# EAGLE design RGBW Controller31 (EAGLE 6.5.0)
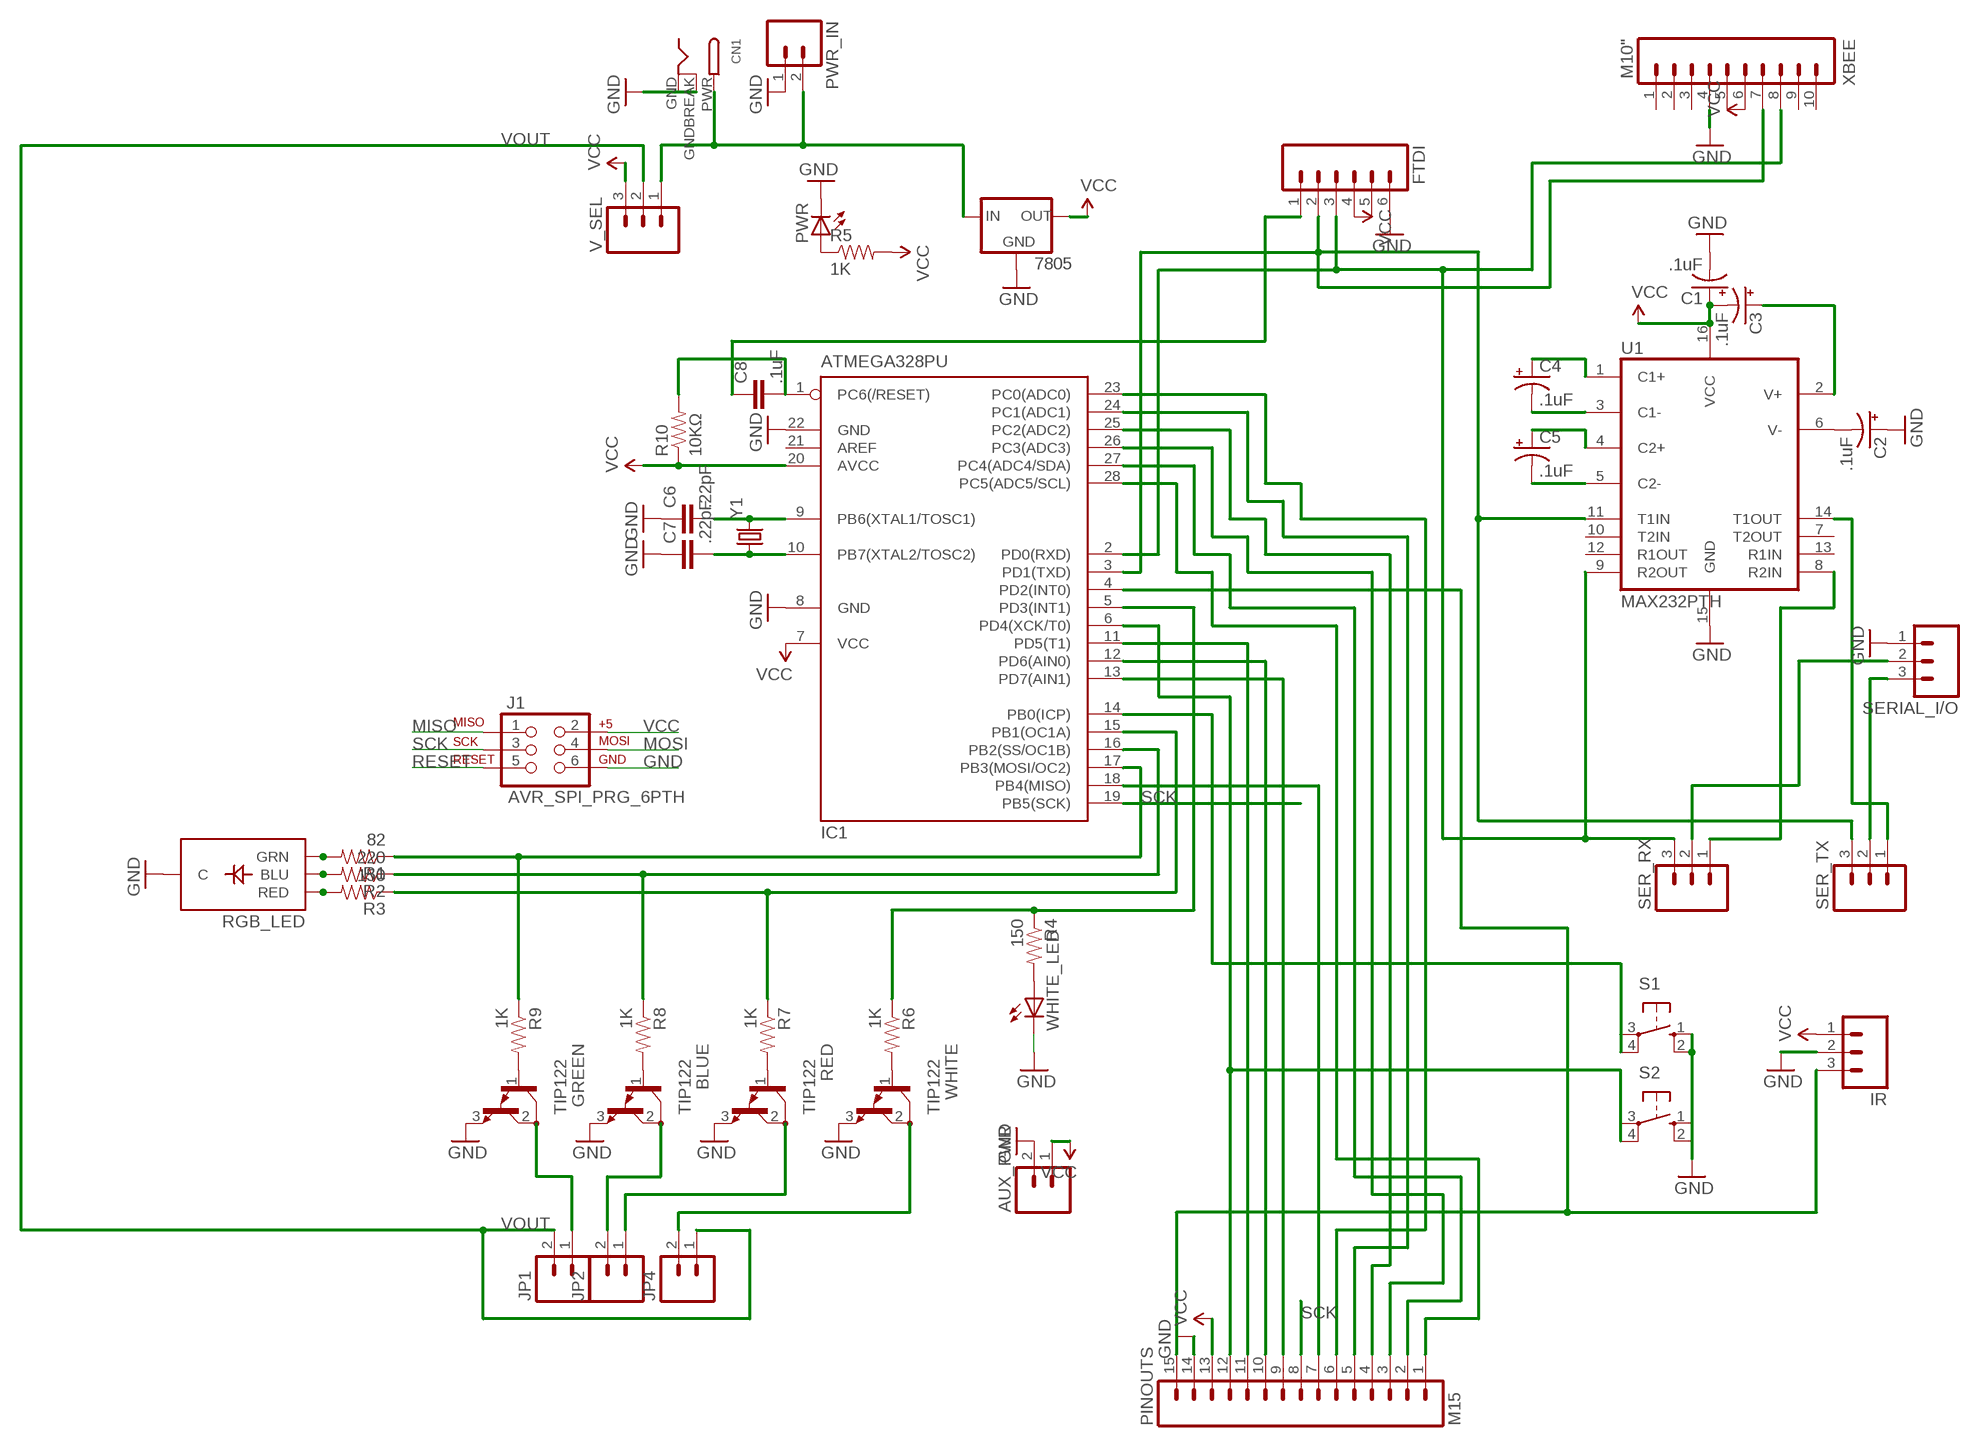
[diagram p0: schematic, sheet 1]

## Parts
7805  V_REG_78XXSIDE  [78XXL]
AUX_PWR  M02PTH  [1X02]
BLUE  TIP122  [TO220]
C1  .1uF  CAP_POLPTH1  [CPOL-RADIAL-100UF-25V]
C2  .1uF  CAP_POLPTH1  [CPOL-RADIAL-100UF-25V]
C3  .1uF  CAP_POLPTH1  [CPOL-RADIAL-100UF-25V]
C4  .1uF  CAP_POLPTH1  [CPOL-RADIAL-100UF-25V]
C5  .1uF  CAP_POLPTH1  [CPOL-RADIAL-100UF-25V]
C6  .22pF  CAPPTH  [CAP-PTH-SMALL]
C7  .22pF  CAPPTH  [CAP-PTH-SMALL]
C8  .1uF  CAPKIT  [CAP-PTH-SMALL-KIT]
CN1  DCBARRELPTH  [DCJACK_2MM_PTH]
FTDI  M06SIP  [1X06]
GREEN  TIP122  [TO220]
IC1  ATMEGA328PU  MEGA8-P  [DIL28-3]
IR  M03PTH  [1X03]
J1  AVR_SPI_PRG_6PTH  [2X3]
JP1  M025MM  [SCREWTERMINAL-5MM-2]
JP2  M025MM  [SCREWTERMINAL-5MM-2]
JP4  M025MM  [SCREWTERMINAL-5MM-2]
PINOUTS  M15  [1X15]
PWR  LED5MM  [LED5MM]
PWR_IN  M025MM  [SCREWTERMINAL-5MM-2]
R1  82  RESISTORPTH-1/4W  [AXIAL-0.4]
R2  220  RESISTORPTH-1/4W  [AXIAL-0.4]
R3  150  RESISTORPTH-1/4W  [AXIAL-0.4]
R4  150  RESISTORPTH-1/4W  [AXIAL-0.4]
R5  1K  RESISTORPTH-1/4W  [AXIAL-0.4]
R6  1K  RESISTORPTH-1/4W  [AXIAL-0.4]
R7  1K  RESISTORPTH-1/4W  [AXIAL-0.4]
R8  1K  RESISTORPTH-1/4W  [AXIAL-0.4]
R9  1K  RESISTORPTH-1/4W  [AXIAL-0.4]
R10  10KΩ  RESISTORPTH-1/4W  [AXIAL-0.4]
RED  TIP122  [TO220]
RGB_LED  LED-TRICOLOR-THROUGHHOLE  [LED-TRICOLOR-THROUGHHOLE]
S1  10-XX  [B3F-10XX]
S2  10-XX  [B3F-10XX]
SER_RX  M03PTH  [1X03]
SER_TX  M03PTH  [1X03]
SERIAL_I/O  M03SCREW  [SCREWTERMINAL-3.5MM-3]
U1  MAX232PTH  [DIL16]
V_SEL  M03PTH  [1X03]
WHITE  TIP122  [TO220]
WHITE_LED  LED5MM  [LED5MM]
XBEE  M10"  [1X10]
Y1  CRYSTALHC49US  [HC49US]

## Nets
GND: 7805.GND AUX_PWR.2 BLUE.3(E) C1.2(-) C2.1(+) C6.1 C7.1 CN1.GND CN1.GNDBREAK FTDI.6 GREEN.3(E) IC1.8(GND) IC1.22(GND) IR.2 J1.6 PINOUTS.14 PWR.K(C) PWR_IN.1 RED.3(E) RGB_LED.GND(C) S1.1(S) S1.2(S1) S2.1(S) S2.2(S1) SERIAL_I/O.1 U1.15(GND) WHITE.3(E) WHITE_LED.K(C) XBEE.4
MISO: IC1.18(PB4(MISO)) J1.1 PINOUTS.7
MOSI: IC1.17(PB3(MOSI/OC2)) J1.4 R1.P$1 R9.P$1
N$1: R1.P$2 RGB_LED.GRN
N$2: R2.P$2 RGB_LED.BLU
N$3: R3.P$2 RGB_LED.RED
N$4: R4.P$2 WHITE_LED.A
N$5: PWR.A R5.P$1
N$6: C5.1(+) U1.4(C2+)
N$7: C4.2(-) U1.3(C1-)
N$8: C4.1(+) U1.1(C1+)
N$9: C5.2(-) U1.5(C2-)
N$11: C3.1(+) U1.2(V+)
N$12: C2.2(-) U1.6(V-)
N$13: IC1.5(PD3(INT1)) R4.P$1 R6.P$1
N$14: IC1.15(PB1(OC1A)) R3.P$1 R7.P$1
N$15: IC1.16(PB2(SS/OC1B)) R2.P$1 R8.P$1
N$17: C6.2 IC1.9(PB6(XTAL1/TOSC1)) Y1.2
N$18: C7.2 IC1.10(PB7(XTAL2/TOSC2)) Y1.1
N$19: IC1.4(PD2(INT0)) IR.3 PINOUTS.15
N$20: 7805.IN CN1.PWR PWR_IN.2 V_SEL.1
N$21: GREEN.2(C) JP1.1
N$23: BLUE.2(C) JP2.2
N$24: JP2.1 RED.2(C)
N$25: JP4.2 WHITE.2(C)
N$26: IC1.14(PB0(ICP)) S1.3(P) S1.4(P1)
N$28: C8.1 FTDI.1
N$29: FTDI.2 IC1.3(PD1(TXD)) SER_TX.3 U1.11(T1IN) XBEE.7
N$30: FTDI.3 IC1.2(PD0(RXD)) SER_RX.3 U1.9(R2OUT) XBEE.8
N$32: IC1.13(PD7(AIN1)) PINOUTS.9
N$33: IC1.12(PD6(AIN0)) PINOUTS.10
N$34: IC1.11(PD5(T1)) PINOUTS.11
N$35: IC1.26(PC3(ADC3)) PINOUTS.3
N$36: IC1.27(PC4(ADC4/SDA)) PINOUTS.2
N$37: IC1.28(PC5(ADC5/SCL)) PINOUTS.1
N$38: IC1.6(PD4(XCK/T0)) PINOUTS.12 S2.3(P) S2.4(P1)
N$39: IC1.25(PC2(ADC2)) PINOUTS.4
N$40: IC1.24(PC1(ADC1)) PINOUTS.5
N$41: IC1.23(PC0(ADC0)) PINOUTS.6
N$42: SER_TX.2 SERIAL_I/O.3
N$43: SER_RX.2 SERIAL_I/O.2
N$44: SER_TX.1 U1.14(T1OUT)
N$45: SER_RX.1 U1.8(R2IN)
N$46: R7.P$2 RED.1(B)
N$47: BLUE.1(B) R8.P$2
N$48: GREEN.1(B) R9.P$2
N$49: R6.P$2 WHITE.1(B)
RESET: C8.2 IC1.1(PC6(/RESET)) J1.5 R10.P$2
SCK: IC1.19(PB5(SCK)) J1.3 PINOUTS.8
VCC: 7805.OUT AUX_PWR.1 C1.1(+) C3.2(-) FTDI.4 IC1.7(VCC) IC1.20(AVCC) IR.1 J1.2 PINOUTS.13 R5.P$2 R10.P$1 U1.16(VCC) V_SEL.3 XBEE.6
VOUT: JP1.2 JP4.1 V_SEL.2
Unconnected: FTDI.5 IC1.21(AREF) U1.7(T2OUT) U1.10(T2IN) U1.12(R1OUT) U1.13(R1IN) XBEE.1 XBEE.2 XBEE.3 XBEE.5 XBEE.9 XBEE.10

## Library data of the parts
7805 = SparkFun:V_REG_78XX: Voltage Regulator Standard 7805 5V regulator. IGO (Input Ground Output). Spark Fun Electronics SKU : COM-00107
AUX_PWR JP1 JP2 JP4 PWR_IN = SparkFun:M02: Header 2 Standard 2-pin 0.1" header. Use with straight break away headers (SKU : PRT-00116), right angle break away headers (PRT-00553), swiss pins (PRT-00743), machine pins (PRT-00117), and female headers (PRT-00115). Molex polarized connector foot print use with SKU : PRT-08233 with associated crimp pins and housings.
BLUE GREEN RED WHITE = transistor:TIP122: NPN BIPOLAR DARLINGTON TRANSISTOR
C1-C5 = SparkFun:CAP_POL: Capacitor Polarized These are standard SMD and PTH capacitors. Normally 10uF, 47uF, and 100uF in electrolytic and tantalum varieties. Always verify the external diameter of the through hole cap, it varies with capacity, voltage, and manufacturer. The EIA devices should be standard.
C6-C8 = SparkFun:CAP: Capacitor Standard 0603 ceramic capacitor, and 0.1" leaded capacitor.
CN1 = adafruit:DCBARREL: 2.0mm DC Barrel Jack DCJACK_2MM_PTH - Through Hole Jack (4UConnector: 05537)
FTDI = SparkFun:M06: Header 6 Standard 6-pin 0.1" header. Use with straight break away headers (SKU : PRT-00116), right angle break away headers (PRT-00553), swiss pins (PRT-00743), machine pins (PRT-00117), and female headers (PRT-00115). Molex polarized connector foot print use with SKU : PRT-08094 with associated crimp pins and housings. NOTES ON THE VARIANTS LOCK and LOCK_LONGPADS... This footprint was designed to help hold the alignment of a through-hole component (i.e. 6-pin header) while soldering it into place. You may notice that each hole has been shifted either up or down by 0.005 of an inch from it's more standard position (which is a perfectly straight line). This slight alteration caused the pins (the squares in the middle) to touch the edges of the holes. Because they are alternating, it causes a "brace" to hold the component in place. 0.005 has proven to be the perfect amount of "off-center" position when using our standard breakaway headers. Although looks a little odd when you look at the bare footprint, once you have a header in there, the alteration is very hard to notice. Also, if you push a header all the way into place, it is covered up entirely on the bottom side. This idea of altering the position of holes to aid alignment will be further integrated into the Sparkfun Library for other footprints. It can help hold any component with 3 or more connection pins.
IC1 = atmel:MEGA8-P: MICROCONTROLLER 8 Kbytes FLASH, 1 kbytes SRAM, 512 bytes EEPROM, USART, 4-channel 10 bit ADC, 2-channel 8 bit ADC Pin compatible with Atmega48, ATMega88, ATMega168 Source: avr.lbr
IR SER_RX SER_TX SERIAL_I/O V_SEL = SparkFun:M03: Header 3 Standard 3-pin 0.1" header. Use with straight break away headers (SKU : PRT-00116), right angle break away headers (PRT-00553), swiss pins (PRT-00743), machine pins (PRT-00117), and female headers (PRT-00115). Molex polarized connector foot print use with SKU : PRT-08232 with associated crimp pins and housings.
J1 = SparkFun:AVR_SPI_PRG_6: AVR ISP 6 Pin This is the reduced ISP connector for AVR programming. Common on Arduino. This footprint will take up less PCB space and can be used with a 10-pin to 6-pin adapter such as SKU: BOB-08508
PINOUTS = SparkFun:M15: Header 15 Standard 15-pin 0.1" header. Use with straight break away headers (SKU : PRT-00116), right angle break away headers (PRT-00553), swiss pins (PRT-00743), machine pins (PRT-00117), and female headers (PRT-00115).
PWR WHITE_LED = led:LED: LED OSRAM: - CHIPLED LG R971, LG N971, LY N971, LG Q971, LY Q971, LO R971, LY R971 LH N974, LH R974 LS Q976, LO Q976, LY Q976 LO Q996 - Hyper CHIPLED LW Q18S LB Q993, LB Q99A, LB R99A - SideLED LS A670, LO A670, LY A670, LG A670, LP A670 LB A673, LV A673, LT A673, LW A673 LH A674 LY A675 LS A676, LA A676, LO A676, LY A676, LW A676 LS A679, LY A679, LG A679 - Hyper Micro SIDELED® LS Y876, LA Y876, LO Y876, LY Y876 LT Y87S - SmartLED LW L88C, LW L88S LB L89C, LB L89S, LG L890 LS L89K, LO L89K, LY L89K LS L896, LA L896, LO L896, LY L896 - TOPLED LS T670, LO T670, LY T670, LG T670, LP T670 LSG T670, LSP T670, LSY T670, LOP T670, LYG T670 LG T671, LOG T671, LSG T671 LB T673, LV T673, LT T673, LW T673 LH T674 LS T676, LA T676, LO T676, LY T676, LB T676, LH T676, LSB T676, LW T676 LB T67C, LV T67C, LT T67C, LS T67K, LO T67K, LY T67K, LW E67C LS E67B, LA E67B, LO E67B, LY E67B, LB E67C, LV E67C, LT E67C LW T67C LS T679, LY T679, LG T679 LS T770, LO T770, LY T770, LG T770, LP T770 LB T773, LV T773, LT T773, LW T773 LH T774 LS E675, LA E675, LY E675, LS T675 LS T776, LA T776, LO T776, LY T776, LB T776 LHGB T686 LT T68C, LB T68C - Hyper Mini TOPLED® LB M676 - Mini TOPLED Santana® LG M470 LS M47K, LO M47K, LY M47K Source: http://www.osram.convergy.de LUXEON: - LUMILED® LXK2-PW12-R00, LXK2-PW12-S00, LXK2-PW14-U00, LXK2-PW14-V00 LXK2-PM12-R00, LXK2-PM12-S00, LXK2-PM14-U00 LXK2-PE12-Q00, LXK2-PE12-R00, LXK2-PE12-S00, LXK2-PE14-T00, LXK2-PE14-U00 LXK2-PB12-K00, LXK2-PB12-L00, LXK2-PB12-M00, LXK2-PB14-N00, LXK2-PB14-P00, LXK2-PB14-Q00 LXK2-PR12-L00, LXK2-PR12-M00, LXK2-PR14-Q00, LXK2-PR14-R00 LXK2-PD12-Q00, LXK2-PD12-R00, LXK2-PD12-S00 LXK2-PH12-R00, LXK2-PH12-S00 LXK2-PL12-P00, LXK2-PL12-Q00, LXK2-PL12-R00 Source: www.luxeon.com KINGBRIGHT: KA-3528ASYC Source: www.kingbright.com
R1-R10 = SparkFun:RESISTOR: Resistor Basic schematic elements and footprints for 0603, 1206, and PTH resistors.
RGB_LED = SparkFun:LED-TRICOLOR-THROUGHHOLE
S1 S2 = switch-omron:10-XX: OMRON SWITCH; MPN: B3F-1000; OC_FARNELL: 176432; OC_NEWARK: 36M3542
U1 = SparkFun:MAX232: RS232 Transceiver Very common IC. This is generically called 'MAX232', but works with the 3V equivalent MAX3232 generic ICs. Field tested and mother approved. Spark Fun Electronics SKU : COM-00316 (DIP) and COM-00589 (SMD)
XBEE = SparkFun:M10: Header 10 Standard 10-pin 0.1" header. Use with straight break away headers (SKU : PRT-00116), right angle break away headers (PRT-00553), swiss pins (PRT-00743), machine pins (PRT-00117), and female headers (PRT-00115).
Y1 = SparkFun:CRYSTAL: Crystals Various standard crystals. Proven footprints. Spark Fun Electronics SKU : COM-00534

## Board
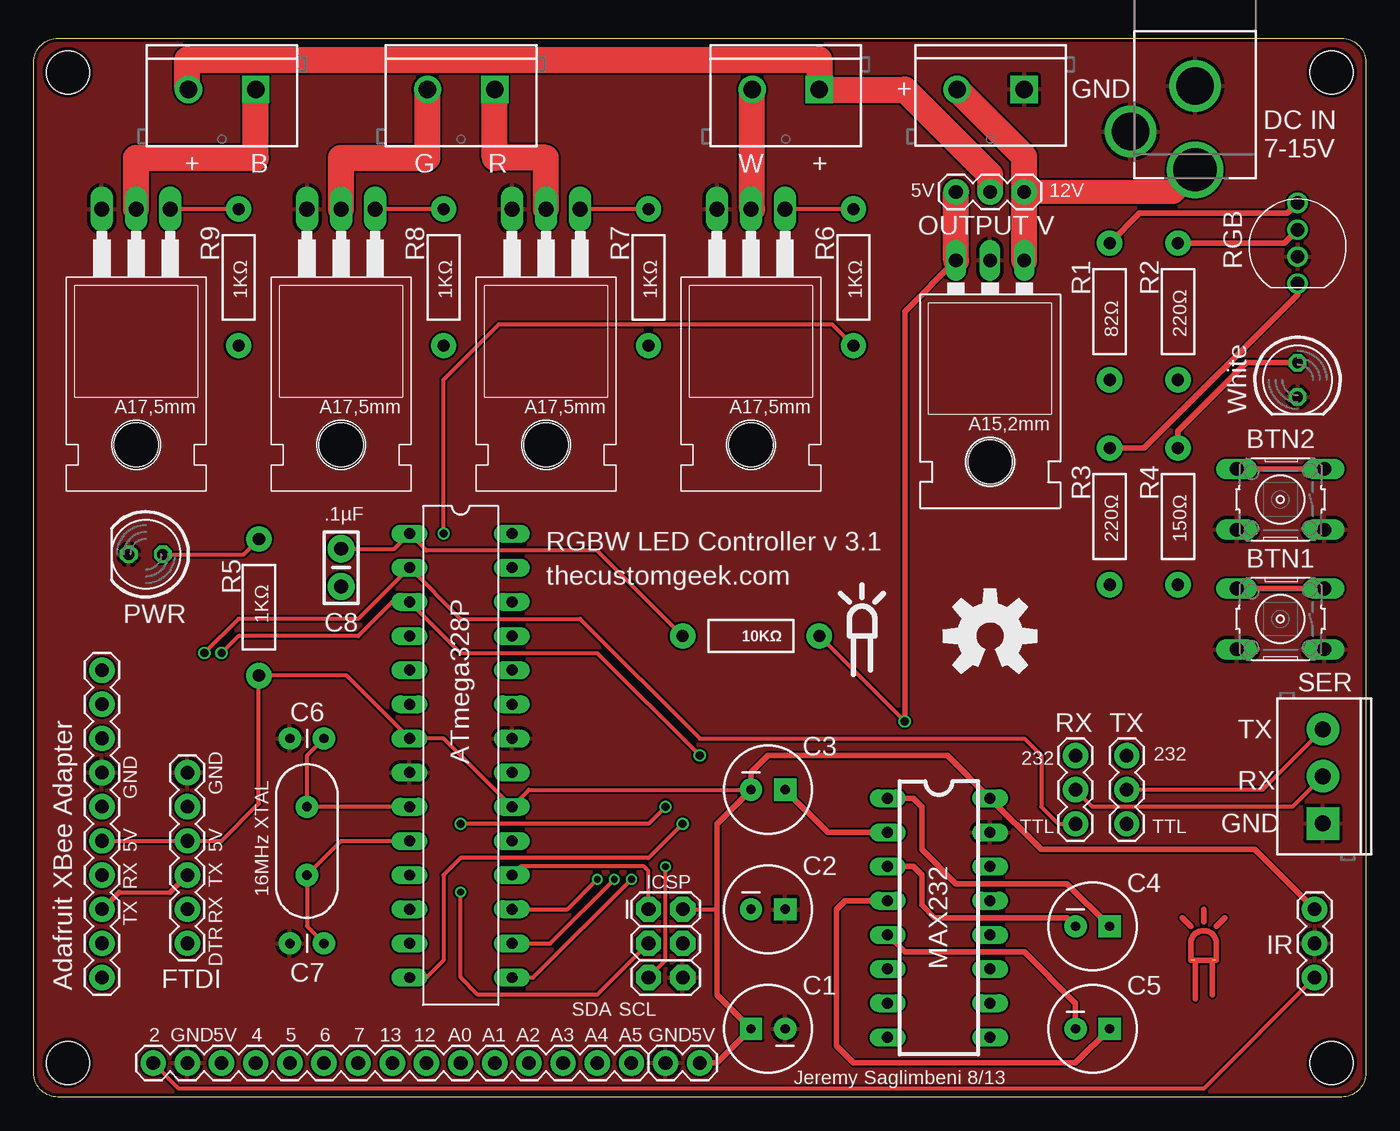
[diagram p1: board, top side]
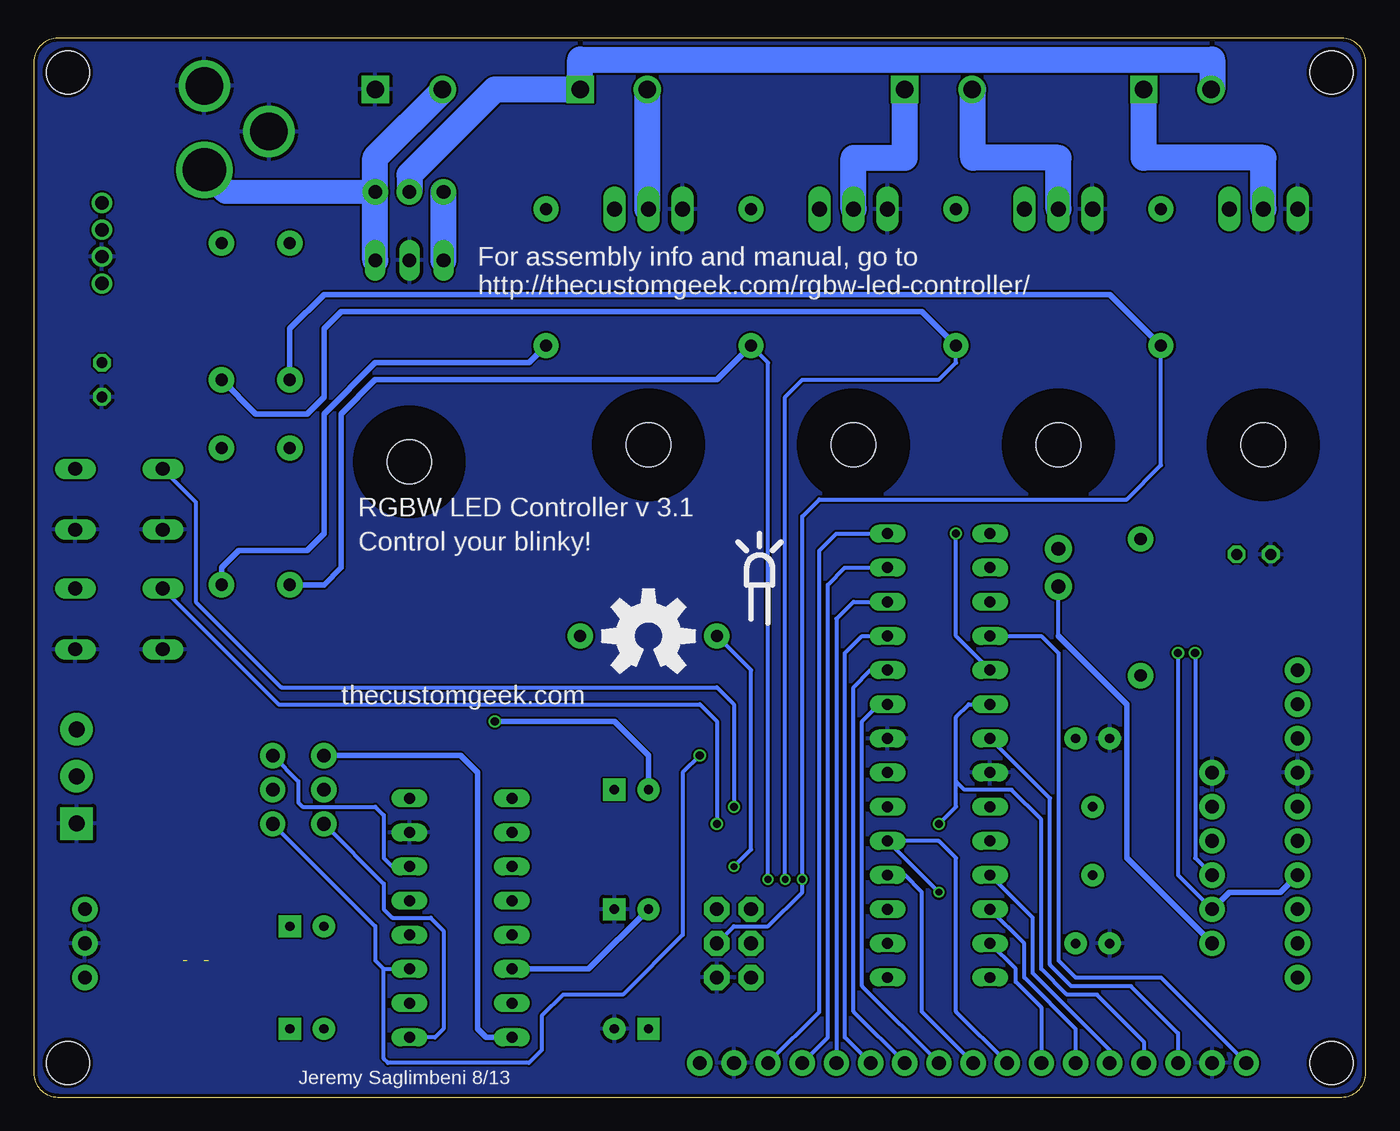
[diagram p2: board, bottom side, seen from below]

Size 99.06 x 78.74 mm. Coordinates in mm from the lower left corner, seen from the top.
Outline: 99.06,76.94 99.06,1.8 arc-90 97.26,0 1.8,0 arc-90 0,1.8 0,76.94 arc-90 1.8,78.74 97.26,78.74 arc-90 99.06,76.94
Copper layers (1*16): Top 0.035mm / dielectric 1.5mm / Bottom 0.035mm
Design rules "Fusion_eagle_rule_v1.1": minimum track width 6mil, minimum drill 12mil, track to track 6mil, track to pad 6mil, pad to pad 6mil, via to via 6mil, smd to smd 0mil, copper to edge 10mil, drill to drill 10mil, minimum pad ring 10mil, minimum via ring 6mil, stop-mask expansion 2mil, vias tented up to drill 100mil, thermal gap 10mil
Holes 3.2 mm at 2.54,76.2 96.52,76.2 96.52,2.54 2.54,2.54

### Footprints (pad centres in the part's own frame; a part is rotated, then mirrored left to right if it is on the bottom)
78XXL = drill 1.016 long: GND 0,-3.81; IN -2.54,-3.81; OUT 2.54,-3.81 | hole 3.302: 0,11.176
1X02 = drill 1.016 pad 1.88: 1 0,0; 2 2.54,0
TO220 = drill 1.118 long: 1 -2.54,-6.35; 2 0,-6.35; 3 2.54,-6.35 | hole 3.302: 0,11.176
CPOL-RADIAL-100UF-25V = drill 0.7 pad 1.651 square: 1 1.27,0 | drill 0.7 pad 1.651: 2 -1.27,0
CAP-PTH-SMALL = drill 0.7 pad 1.651: 1 0,0; 2 2.54,0
CAP-PTH-SMALL-KIT = drill 1.016 pad 2.032: 1 -1.397,0; 2 1.397,0
DCJACK_2MM_PTH = drill 2.8: GND 0,7.35; GNDBREAK 4.8,10.75 | drill 3.2: PWR 0,13.6
1X06 = drill 1.016 pad 1.88: 1 0,0; 2 2.54,0; 3 5.08,0; 4 7.62,0; 5 10.16,0; 6 12.7,0
DIL28-3 = drill 0.813 long: 1 -16.51,-3.81; 2 -13.97,-3.81; 3 -11.43,-3.81; 4 -8.89,-3.81; 5 -6.35,-3.81; 6 -3.81,-3.81; 7 -1.27,-3.81; 8 1.27,-3.81; 9 3.81,-3.81; 10 6.35,-3.81; 11 8.89,-3.81; 12 11.43,-3.81; 13 13.97,-3.81; 14 16.51,-3.81; 15 16.51,3.81; 16 13.97,3.81; 17 11.43,3.81; 18 8.89,3.81; 19 6.35,3.81; 20 3.81,3.81; 21 1.27,3.81; 22 -1.27,3.81; 23 -3.81,3.81; 24 -6.35,3.81; 25 -8.89,3.81; 26 -11.43,3.81; 27 -13.97,3.81; 28 -16.51,3.81
1X03 = drill 1.016 pad 1.88: 1 0,0; 2 2.54,0; 3 5.08,0
2X3 = drill 1.016 pad 1.88 octagon: 1 0,0; 2 0,2.54; 3 2.54,0; 4 2.54,2.54; 5 5.08,0; 6 5.08,2.54
SCREWTERMINAL-5MM-2 = drill 1.3 pad 2.032 square: 1 0,0 | drill 1.3 pad 2.032: 2 5,0
1X15 = drill 1.016 pad 1.88: 1 0,0; 2 2.54,0; 3 5.08,0; 4 7.62,0; 5 10.16,0; 6 12.7,0; 7 15.24,0; 8 17.78,0; 9 20.32,0; 10 22.86,0; 11 25.4,0; 12 27.94,0; 13 30.48,0; 14 33.02,0; 15 35.56,0
LED5MM = drill 0.813 octagon: A -1.27,0; K 1.27,0
AXIAL-0.4 = drill 0.9 pad 1.88: P$1 -5.08,0; P$2 5.08,0
LED-TRICOLOR-THROUGHHOLE = drill 1: BLU 1,0; GND -1,0; GRN 3,0; RED -3,0
B3F-10XX = drill 1.016 long: 1 -3.251,2.261; 2 3.251,2.261; 3 -3.251,-2.261; 4 3.251,-2.261
SCREWTERMINAL-3.5MM-3 = drill 1.2 pad 2.413 square: 1 0,0 | drill 1.2 pad 2.413: 2 3.5,0; 3 7,0
DIL16 = drill 0.813 long: 1 -8.89,-3.81; 2 -6.35,-3.81; 3 -3.81,-3.81; 4 -1.27,-3.81; 5 1.27,-3.81; 6 3.81,-3.81; 7 6.35,-3.81; 8 8.89,-3.81; 9 8.89,3.81; 10 6.35,3.81; 11 3.81,3.81; 12 1.27,3.81; 13 -1.27,3.81; 14 -3.81,3.81; 15 -6.35,3.81; 16 -8.89,3.81
1X10 = drill 1.016 pad 1.88: 1 0,0; 2 2.54,0; 3 5.08,0; 4 7.62,0; 5 10.16,0; 6 12.7,0; 7 15.24,0; 8 17.78,0; 9 20.32,0; 10 22.86,0
HC49US = drill 0.7 pad 1.651: 1 -2.54,0; 2 2.54,0

### Placement (x,y rotation side)
7805  71.12,58.42 180 top
AUX_PWR  49.53,2.54 180 top
BLUE  22.86,59.69 180 top
C1  54.61,5.08 180 top
C2  54.61,13.97 0 top
C3  54.61,22.86 0 top
C4  78.74,12.7 0 top
C5  78.74,5.08 0 top
C6  19.05,26.67 0 top
C7  19.05,11.43 0 top
C8  22.86,39.37 90 top
CN1  86.36,82.55 180 top
FTDI  11.43,11.43 90 top
GREEN  7.62,59.69 180 top
IC1  31.75,25.4 270 top
IR  95.25,13.97 270 top
J1  45.72,13.97 270 top
JP1  16.51,74.93 180 top
JP2  34.29,74.93 180 top
JP4  58.42,74.93 180 top
PINOUTS  44.45,2.54 180 top
PWR  8.34,40.36 180 top
PWR_IN  73.65,74.94 180 top
R1  80.01,58.42 90 top
R2  85.09,58.42 90 top
R3  80.01,43.18 90 top
R4  85.09,43.18 90 top
R5  16.75,36.43 270 top
R6  60.96,60.96 90 top
R7  45.72,60.96 90 top
R8  30.48,60.96 90 top
R9  15.24,60.96 90 top
R10  53.34,34.29 180 top
RED  38.1,59.69 180 top
RGB_LED  93.98,63.5 90 top
S1  92.71,35.56 180 top
S2  92.71,44.45 180 top
SER_RX  77.47,25.4 270 top
SER_TX  81.28,25.4 270 top
SERIAL_I/O  95.86,20.35 90 top
U1  67.31,13.34 270 top
U$1  [OSHW-LOGO-L]  71.12,34.29 0 top
U$2  [OSHW-LOGO-L]  53.34,34.29 0 bottom
V_SEL  73.66,67.31 180 top
WHITE  53.34,59.69 180 top
WHITE_LED  93.98,53.34 270 top
XBEE  5.08,31.75 270 top
Y1  20.32,19.05 90 top

### Tracks (layer width: path | path; a pad name or v marks a point on that pad's centre or on a via)
GND
  pour Bottom: 97.26,0 1.8,0 arc-90 0,1.8 0,76.94 arc-90 1.8,78.74 97.26,78.74 arc-90 99.06,76.94 99.06,1.8 arc-90
  pour Top: 97.26,0 1.8,0 arc-90 0,1.8 0,76.94 arc-90 1.8,78.74 97.26,78.74 arc-90 99.06,76.94 99.06,1.8 arc-90
LED  (2 unrouted)
  Top 0.406: 86.36,7.3 86.36,10.16 | 87.63,7.62 87.63,10.16 | 86.04,10.16 86.04,11.43 arc-180 87.95,11.43 87.95,10.16 86.04,10.16
MISO
  Top 0.305: J1.1 45.72,16.83 45.4,17.14 36.2,17.14 IC1.18
  Bottom 0.305: IC1.18 34.29,16.51 33.02,15.24 33.02,6.35 PINOUTS.7
MOSI  (via drill 0.5)
  Top 0.305: IC1.17 39.69,13.97 v41.91,16.19
  Bottom 0.305: R9.P$1 15.24,46.99 17.78,44.45 40.64,44.45 41.91,43.18 v41.91,16.19 41.91,15.24 44.45,12.7 46.99,12.7 J1.4
  Bottom 0.406: R9.P$1 19.05,59.69 77.47,59.69 80.01,57.15 R1.P$1
N$1
  Top 0.406: R1.P$2 82.23,65.72 93.2,65.72 RGB_LED.GRN
N$2
  Top 0.406: R2.P$2 92.98,63.5 RGB_LED.BLU
N$3
  Top 0.406: R3.P$2 82.55,48.26 93.98,59.69 RGB_LED.RED
N$4
  Top 0.406: R4.P$2 85.09,49.53 90.17,54.61 WHITE_LED.A
N$5
  Top 0.305: PWR.A 15.61,40.36 R5.P$1
N$6
  Top 0.406: C5.1 77.47,2.54 60.96,2.54 59.69,3.81 59.69,13.97 60.33,14.61 U1.4
N$7
  Top 0.406: C4.2 76.83,13.34 66.99,13.34 66.04,14.29 66.04,16.51 65.41,17.14 U1.3
N$8
  Top 0.406: C4.1 76.83,15.88 68.58,15.88 66.04,18.41 66.04,21.59 65.41,22.23 U1.1
N$9
  Top 0.406: C5.2 77.47,6.99 73.66,10.79 64.77,10.79 U1.5
N$11
  Top 0.406: U1.2 59.05,19.68 C3.1
N$12
  Bottom 0.406: U1.6 57.78,9.53 C2.2
N$13  (via drill 0.6)
  Top 0.305: v30.48,41.91 30.48,53.34 34.61,57.47 59.37,57.47 R6.P$1
  Bottom 0.305: IC1.5 30.48,34.29 v30.48,41.91
  Bottom 0.406: R6.P$1 62.23,54.61 73.66,54.61 77.47,50.8 77.47,41.91 78.74,40.64 83.82,40.64 85.09,39.37 R4.P$1
N$14  (via drill 0.5)
  Top 0.305: IC1.15 37.15,8.89 v44.45,16.19
  Bottom 0.305: v44.45,16.19 44.45,54.61 R7.P$1
  Bottom 0.406: R7.P$1 48.26,53.34 73.66,53.34 76.2,50.8 76.2,39.37 77.47,38.1 R3.P$1
N$15  (via drill 0.5)
  Top 0.305: IC1.16 38.42,11.43 v43.18,16.19
  Bottom 0.305: R8.P$1 30.48,54.61 31.75,53.34 41.91,53.34 43.18,52.07 v43.18,16.19
  Bottom 0.406: R8.P$1 33.02,58.42 76.2,58.42 77.47,57.15 77.47,52.07 78.74,50.8 82.55,50.8 R2.P$1
N$17
  Top 0.305: IC1.9 Y1.2 20.32,25.4 C6.2
N$18
  Top 0.305: C7.2 20.32,12.7 Y1.1 22.86,19.05 IC1.10
N$19
  Top 0.305: IR.3 87,0.64 10.79,0.64 PINOUTS.15
  Bottom 0.305: IC1.4 24.13,34.29 22.86,33.02 22.86,10.16 21.59,8.89 15.24,8.89 PINOUTS.15
N$20
  Top 1.778: CN1.PWR 84.72,67.31 V_SEL.1
  Top 1.93: PWR_IN.2 73.66,69.93 V_SEL.1 7805.IN
  Bottom 1.778: V_SEL.1 84.77,67.31 86.36,68.9
  Bottom 1.93: 7805.IN V_SEL.1 73.66,69.85 68.58,74.93
N$21
  Top 1.93: GREEN.2 7.62,69.85 16.51,69.85 JP1.1
  Bottom 1.93: GREEN.2 7.62,69.85 16.51,69.85 JP1.1
N$23
  Top 1.93: BLUE.2 22.86,69.85 29.29,69.85 JP2.2
  Bottom 1.93: BLUE.2 22.86,69.85 29.21,69.85 29.21,74.93
N$24
  Top 1.93: RED.2 38.1,69.85 34.29,69.85 JP2.1
  Bottom 1.93: RED.2 38.1,69.85 34.29,69.85 JP2.1
N$25
  Top 1.422: WHITE.2 53.42,66.04
  Top 1.93: 53.42,66.04 JP4.2
  Bottom 1.422: WHITE.2 53.43,66.04 | JP4.2 53.34,74.94 53.34,74.93
  Bottom 1.93: 53.43,66.04 JP4.2
N$26  (via drill 0.6)
  Top 0.305: v48.26,20.32 45.72,17.78 31.75,17.78 30.48,16.51 30.48,10.16 29.21,8.89 IC1.14
  Top 0.406: S1.4 S1.3
  Bottom 0.305: S1.4 80.85,29.21 49.53,29.21 48.26,27.94 v48.26,20.32
N$28
  Bottom 0.305: 22.86,34.29 C8.1
  Bottom 0.406: FTDI.1 17.78,17.78 17.78,29.21 22.86,34.29
N$29  (via drill 0.6)
  Top 0.305: v49.53,25.4 41.91,33.02 31.75,33.02 IC1.3 26.67,36.83 24.13,34.29 15.24,34.29 v13.97,33.02
  Bottom 0.305: SER_TX.3 73.66,12.7 73.66,10.16 73.03,9.53 | 73.03,9.53 U1.11 | v49.53,25.4 50.8,24.13 50.8,12.06 55.24,7.62 59.69,7.62 61.28,6.03 61.28,3.49 62.23,2.54 72.71,2.54 73.03,2.86 73.03,9.53 | v13.97,33.02 13.97,16.51 FTDI.2
  Bottom 0.406: XBEE.7 6.35,15.24 10.16,15.24 FTDI.2
N$30  (via drill 0.6)
  Top 0.305: 6.35,15.24 10.16,15.24 | SER_RX.3 76.2,20.32 74.93,21.59 74.93,25.4 73.66,26.67 49.53,26.67 40.64,35.56 31.75,35.56 IC1.2 24.13,35.56 15.24,35.56 v12.7,33.02
  Top 0.406: XBEE.8 6.35,15.24 | 10.16,15.24 FTDI.3
  Bottom 0.305: SER_RX.3 73.03,15.88 73.03,13.97 72.39,13.34 69.53,13.34 68.58,12.38 68.58,5.08 69.22,4.45 U1.9 | v12.7,33.02 12.7,17.78 FTDI.3
N$32
  Bottom 0.305: IC1.13 26.04,9.53 26.04,8.57 24.13,6.67 PINOUTS.9
N$33
  Bottom 0.305: IC1.12 25.4,11.43 25.4,8.89 21.59,5.08 PINOUTS.10
N$34
  Bottom 0.305: IC1.11 24.77,13.34 24.77,9.21 19.05,3.49 PINOUTS.11
N$35
  Bottom 0.305: IC1.26 38.1,36.83 39.37,35.56 PINOUTS.3
N$36
  Bottom 0.305: IC1.27 38.73,39.37 40.01,38.1 40.01,4.45 PINOUTS.2
N$37
  Bottom 0.305: IC1.28 39.37,41.91 40.64,40.64 40.64,6.35 PINOUTS.1
N$38  (via drill 0.6)
  Top 0.305: v46.99,21.59 45.72,20.32 v31.75,20.32
  Top 0.406: S2.4 S2.3
  Bottom 0.305: 30.48,23.5 29.84,22.86 26.35,22.86 24.13,20.64 24.13,9.53 22.23,7.62 20,7.62 16.51,4.13 PINOUTS.12 | 30.48,23.5 30.48,28.26 29.53,29.21 IC1.6 | S2.4 87,44.25 87,36.83 80.64,30.48 48.26,30.48 46.99,29.21 v46.99,21.59 | v31.75,20.32 30.48,21.59 30.48,23.5
N$39
  Bottom 0.305: IC1.25 37.47,34.29 38.73,33.02 38.73,4.45 PINOUTS.4
N$40
  Bottom 0.305: IC1.24 36.83,31.75 38.1,30.48 38.1,6.35 PINOUTS.5
N$41
  Bottom 0.305: IC1.23 36.2,29.21 37.47,27.94 37.47,8.26 PINOUTS.6
N$42
  Top 0.305: SERIAL_I/O.3 91.37,22.86 SER_TX.2
N$43
  Top 0.305: SERIAL_I/O.2 93.6,21.59 78.74,21.59 SER_RX.2
N$44
  Bottom 0.305: SER_TX.1 79.38,23.5 79.38,21.91 79.06,21.59 73.66,21.59 73.03,20.95 73.03,17.78 72.39,17.14 U1.14
N$45
  Bottom 0.406: SER_RX.1 67.31,25.4 66.04,24.13 66.04,5.08 65.41,4.45 U1.8
N$46
  Top 0.305: R7.P$2 RED.1
N$47
  Top 0.305: R8.P$2 BLUE.1
N$48
  Top 0.305: R9.P$2 GREEN.1
N$49
  Top 0.305: R6.P$2 WHITE.1
N$53
  Top 0.406: 87.95,12.7 88.58,13.34
N$54
  Top 0.406: 87,13.02 87,13.97
N$55
  Top 0.406: 86.04,12.7 85.41,13.34
RESET  (via drill 0.5)
  Top 0.305: C8.2 26.8,40.77 IC1.1 29.21,40.64 41.91,40.64 R10.P$2 | J1.5 46.99,10.16 v46.99,17.14
  Bottom 0.305: v46.99,17.14 45.72,18.41 45.72,31.75 R10.P$2
SCK  (via drill 0.5)
  Top 0.305: J1.3 41.91,7.62 33.02,7.62 31.75,8.89 v31.75,15.24
  Bottom 0.305: PINOUTS.8 30.48,6.35 30.48,17.78 31.75,19.05 IC1.19 v31.75,15.24
VCC  (via drill 0.6)
  Top 0.305: XBEE.6 FTDI.4 13.97,19.05 16.75,21.83 R5.P$2 23.26,31.35 IC1.7 30.48,26.67 IC1.20 36.83,22.86 C3.2 | R10.P$1 v64.77,27.94 | J1.2 50.8,13.97
  Top 0.406: C3.2 52.07,21.59 | C3.2 50.8,20.32 50.8,13.97 50.8,7.62 C1.1 50.8,2.54 AUX_PWR.1 | C3.2 53.34,24.13 54.61,25.4 67.94,25.4 U1.16 74.93,18.41 90.81,18.41 IR.1 | 7805.OUT 64.77,58.42 v64.77,27.94
  Top 1.93: 7805.OUT V_SEL.3
  Bottom 0.305: IC1.7 23.5,22.23 23.5,9.84 21.91,8.26 17.46,8.26 13.97,4.76 PINOUTS.13
  Bottom 0.406: v64.77,27.94 55.88,27.94 53.34,25.4 C3.2
  Bottom 1.93: 7805.OUT V_SEL.3
VOUT
  Top 1.422: JP1.2 11.43,74.93
  Top 1.93: 11.43,74.93 11.43,77.15 58.42,77.15 JP4.1 64.77,74.93 71.12,68.58 V_SEL.2
  Bottom 1.93: 11.43,74.93 11.43,77.15 58.42,77.15 JP4.1 64.77,74.93 71.12,68.58 V_SEL.2

### Text on the board
tPlace: + | GND | + | B | G | R | W | + | DC IN / 7-15V | 5V | 12V | R9 | R8 | R7 | R6 | OUTPUT V | R1 | R2 | RGB | 1KΩ | 1KΩ | 1KΩ | 1KΩ | 82Ω | 220Ω | White | BTN2 | R3 | R4 | .1µF | RGBW LED Controller v 3.1 | 220Ω | 150Ω | R5 | BTN1 | thecustomgeek.com | PWR | 1KΩ | C8 | SER | RX | TX | C6 | TX | GND | 232 | 232 | GND | ATmega328P | C3 | RX | TTL | TTL | 5V | 5V | GND | RX | TX | ICSP | C2 | TX | RX | 16MHz XTAL | C4 | DTR | IR | FTDI | MAX232 | C7 | Adafruit XBee Adapter | C1 | C5 | SDA | SCL | 2 | GND | 5V | 4 | 5 | 6 | 7 | 13 | 12 | A0 | A1 | A2 | A3 | A4 | A5 | GND | 5V | Jeremy Saglimbeni 8/13
bPlace: For assembly info and manual, go to / http://thecustomgeek.com/rgbw-led-controller/ | RGBW LED Controller v 3.1 | Control your blinky! | thecustomgeek.com | Jeremy Saglimbeni 8/13